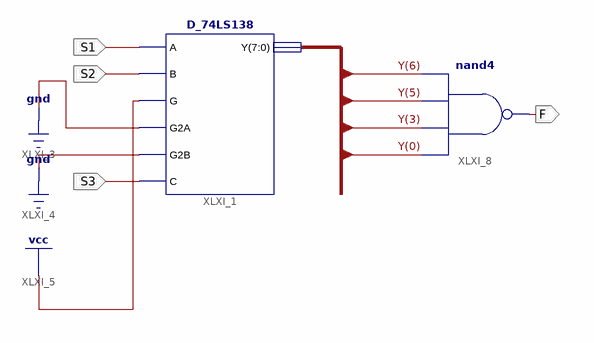
[diagram p0: schematic sheet 1]
// Xilinx ISE schematic LampCtrl.sch (kintex7) as structural Verilog: 2 symbols, 4 ports
module LampCtrl (
  input  S2,
  input  S3,
  input  S1,
  output F
);

  wire [7:0] Y;

  D_74LS138 XLXI_1 (.A(S1), .B(S2), .G(1'b1), .G2A(1'b0), .G2B(1'b0), .C(S3), .Y(Y));
  nand XLXI_8 (F, Y[0], Y[3], Y[5], Y[6]);
endmodule
